# EAGLE design ECE411_G16_V10 (EAGLE 9.2.1)
Version 6: Added bypass capacitors to uC +Vcc, added test points for I2C.
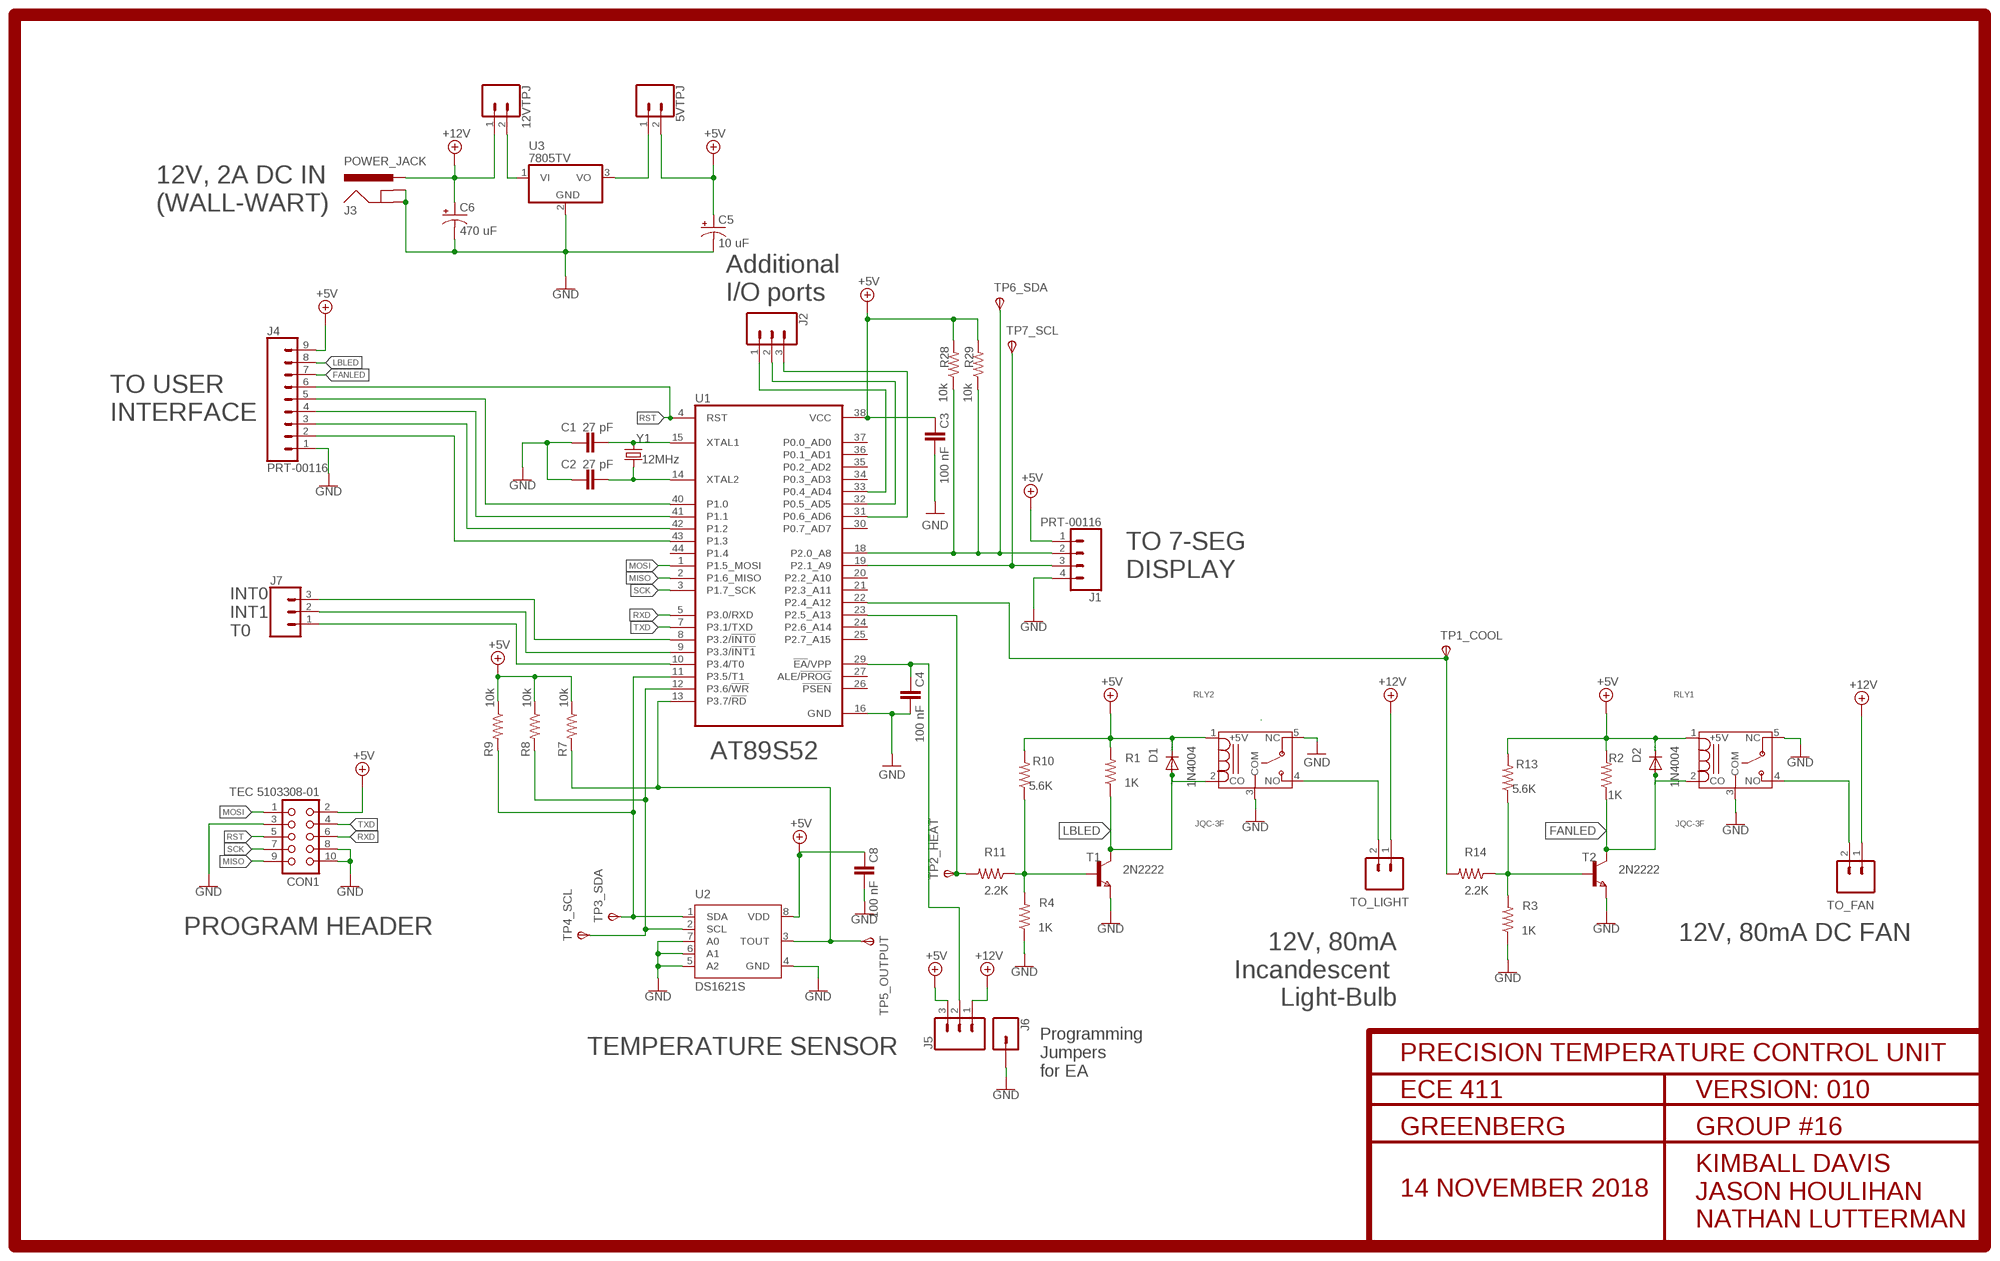
[diagram p0: schematic, sheet 1]

## Parts
5VTPJ  CONN_02  [1X02]
12VTPJ  CONN_02  [1X02]
C1  27 pF  CAPACITOR_0603_M  [RESC0603_M]
C2  27 pF  CAPACITOR_0603_M  [RESC0603_M]
C3  100 nF  CAPACITOR_0603_M  [RESC0603_M]
C4  100 nF  CAPACITOR_0603_M  [RESC0603_M]
C5  10 uF  CPOL-USTT2D6  [TT2D6]
C6  470 uF  CPOL-USTT5D11  [TT5D11]
C8  100 nF  CAPACITOR_0603_M  [RESC0603_M]
CON1  TEC 5103308-01  CON10  [CON10]
D1  1N4004  [DO41-10]
D2  1N4004  [DO41-10]
J1  PRT-00116  CONN_04  [1X04]
J2  CONN_03  [1X03]
J3  POWER_JACK  [POWER_JACK_PTH]
J4  PRT-00116  CONN_09  [1X09]
J5  CONN_03  [1X03]
J6  CONN_01  [1X01]
J7  CONN_03  [1X03]
R1  1K  R-US_R0603  [R0603]
R2  1K  R-US_R0603  [R0603]
R3  1K  R-US_R0603  [R0603]
R4  1K  R-US_R0603  [R0603]
R7  10k  R-US_R0603  [R0603]
R8  10k  R-US_R0603  [R0603]
R9  10k  R-US_R0603  [R0603]
R10  5.6K  R-US_R0603  [R0603]
R11  2.2K  R-US_R0603  [R0603]
R13  5.6K  R-US_R0603  [R0603]
R14  2.2K  R-US_R0603  [R0603]
R28  10k  R-US_R0603  [R0603]
R29  10k  R-US_R0603  [R0603]
RLY1  JQC-3F  [T073]
RLY2  JQC-3F  [T073]
T1  2N2222  NPNSOT23  [SOT-23]
T2  2N2222  NPNSOT23  [SOT-23]
TO_FAN  CONN_02  [1X02]
TO_LIGHT  CONN_02  [1X02]
TP1_COOL  TPSTP20SQ  [TP20SQ]
TP2_HEAT  TPSTP20SQ  [TP20SQ]
TP3_SDA  TPSTP20SQ  [TP20SQ]
TP4_SCL  TPSTP20SQ  [TP20SQ]
TP5_OUTPUT  TPSTP20SQ  [TP20SQ]
TP6_SDA  TPSTP20SQ  [TP20SQ]
TP7_SCL  TPSTP20SQ  [TP20SQ]
U1  AT89S52  AT89S51-24P  [TQFP44]
U2  DS1621S  [SO08]
U3  7805TV  [TO220V]
Y1  12MHz  CRYSTAL-12MHZ"  [CRYSTAL-SMD-5X3.2-4PAD]

## Nets
+5V: 5VTPJ.2 C3.2 C5.+ C8.2 CON1.2 D1.C D2.C J1.1 J4.9 J5.3 R1.2 R2.2 R7.1 R8.1 R9.1 R10.2 R13.2 R28.2 R29.2 RLY1.1(+5V) RLY2.1(+5V) U1.38(VCC) U2.8(VDD)
+12V: 12VTPJ.1 C6.+ J3.PWR J5.1 TO_FAN.1 TO_LIGHT.1
FANLED: D2.A J4.7 R2.1 RLY1.2(CO) T2.1(C)
GND: C1.1 C2.1 C3.1 C4.1 C5.- C6.- C8.1 CON1.3 CON1.8 CON1.10 J1.4 J3.GND J3.GNDBREAK J4.1 J6.1 R3.1 R4.1 RLY1.3(COM) RLY1.5(NC) RLY2.3(COM) RLY2.5(NC) T1.2(E) T2.2(E) U1.16(GND) U2.4(GND) U2.5(A2) U2.6(A1) U2.7(A0) U3.2(GND)
LBLED: D1.A J4.8 R1.1 RLY2.2(CO) T1.1(C)
MISO: CON1.9 U1.2(P1.6_MISO)
MOSI: CON1.1 U1.1(P1.5_MOSI)
N$1: C1.2 U1.15(XTAL1) Y1.1
N$2: C2.2 U1.14(XTAL2) Y1.3
N$3: J1.2 R28.1 R29.1 TP6_SDA.TP(PP) U1.18(P2.0_A8)
N$4: J1.3 TP7_SCL.TP(PP) U1.19(P2.1_A9)
N$5: 12VTPJ.2 U3.1(VI)
N$6: 5VTPJ.1 U3.3(VO)
N$7: RLY2.4(NO) TO_LIGHT.2
N$8: C4.2 J5.2 U1.29(!EA!/VPP)
N$9: R7.2 TP5_OUTPUT.TP(PP) U1.13(P3.7/!RD) U2.3(TOUT)
N$10: R8.2 TP4_SCL.TP(PP) U1.12(P3.6/!WR) U2.2(SCL)
N$11: R9.2 TP3_SDA.TP(PP) U1.11(P3.5/T1) U2.1(SDA)
N$12: R11.2 TP2_HEAT.TP(PP) U1.23(P2.5_A13)
N$13: R4.2 R10.1 R11.1 T1.3(B)
N$14: J2.1 U1.33(P0.4_AD4)
N$15: J2.2 U1.32(P0.5_AD5)
N$16: R14.2 TP1_COOL.TP(PP) U1.22(P2.4_A12)
N$17: R3.2 R13.1 R14.1 T2.3(B)
N$18: J2.3 U1.31(P0.6_AD6)
N$20: RLY1.4(NO) TO_FAN.2
N$21: J7.3 U1.8(P3.2/!INT0)
N$22: J7.2 U1.9(P3.3/!INT1)
N$23: J7.1 U1.10(P3.4/T0)
N$34: J4.5 U1.40(P1.0)
N$35: J4.4 U1.41(P1.1)
N$36: J4.3 U1.42(P1.2)
N$37: J4.2 U1.43(P1.3)
RST: CON1.5 J4.6 U1.4(RST)
RXD: CON1.6 U1.5(P3.0/RXD)
SCK: CON1.7 U1.3(P1.7_SCK)
TXD: CON1.4 U1.7(P3.1/TXD)
Unconnected: U1.20(P2.2_A10) U1.21(P2.3_A11) U1.24(P2.6_A14) U1.25(P2.7_A15) U1.26(!PSEN) U1.27(ALE/!PROG) U1.30(P0.7_AD7) U1.34(P0.3_AD3) U1.35(P0.2_AD2) U1.36(P0.1_AD1) U1.37(P0.0_AD0) U1.44(P1.4)

## Notes on the sheet
- 12V, 2A DC IN
  (WALL-WART)
- Additional
  I/O ports
- TO USER
  INTERFACE
- TO 7-SEG 
  DISPLAY
- INT0
  INT1
  T0
- AT89S52
- PROGRAM HEADER | 12V, 80mA DC FAN
- 12V, 80mA
  Incandescent 
  Light-Bulb
- TEMPERATURE SENSOR
- Programming
  Jumpers
  for EA

## Power pins joined to a net without a drawn wire
GND: U1.17(GND)

## Library data of the parts
5VTPJ 12VTPJ TO_FAN TO_LIGHT = SparkFun-Connectors:CONN_02: Multi connection point. Often used as Generic Header-pin footprint for 0.1 inch spaced/style header connections On any of the 0.1 inch spaced packages, you can populate with these: Break Away Headers - Straight <https://www.sparkfun.com/products/116> (PRT-00116) Break Away Male Headers - Right Angle <https://www.sparkfun.com/products/553> (PRT-00553) Female Headers <https://www.sparkfun.com/products/115> (PRT-00115) Break Away Headers - Machine Pin <https://www.sparkfun.com/products/117> (PRT-00117) Break Away Female Headers - Swiss Machine Pin <https://www.sparkfun.com/products/743> (PRT-00743) For SCREWTERMINALS and SPRING TERMINALS visit here: Screw Terimnals on SparkFun.com <https://www.sparkfun.com/search/results?term=Screw+Terminals> (5mm/3.5mm/2.54mm spacing) This device is also useful as a general connection point to wire up your design to another part of your project. Our various solder wires solder well into these plated through hole pads. Hook-Up Wire - Assortment (Stranded, 22 AWG) <https://www.sparkfun.com/products/11375> (PRT-11375) Hook-Up Wire - Assortment (Solid Core, 22 AWG) <https://www.sparkfun.com/products/11367> (PRT-11367) View the entire wire category on our website here <https://www.sparkfun.com/categories/141> Special notes: Molex polarized connector foot print use with: PRT-08233 with associated crimp pins and housings. 2.54_SCREWTERM for use with PRT-10571. 3.5mm Screw Terminal footprints for PRT-08084 5mm Screw Terminal footprints for use with PRT-08432
C1-C4 C8 = Nordic_nRF:CAPACITOR: Generic chip capacitor
C5 C6 = rcl:CPOL-US: POLARIZED CAPACITOR, American symbol; SPICEPREFIX: C
CON1 = con-harting:CON10: CONNECTOR; OC_FARNELL: unknown; OC_NEWARK: unknown
D1 D2 = diode:1N4004: DIODE general purpose rectifier, 1 A
J1 = SparkFun-Connectors:CONN_04: Multi connection point. Often used as Generic Header-pin footprint for 0.1 inch spaced/style header connections On any of the 0.1 inch spaced packages, you can populate with these: Break Away Headers - Straight <https://www.sparkfun.com/products/116> (PRT-00116) Break Away Male Headers - Right Angle <https://www.sparkfun.com/products/553> (PRT-00553) Female Headers <https://www.sparkfun.com/products/115> (PRT-00115) Break Away Headers - Machine Pin <https://www.sparkfun.com/products/117> (PRT-00117) Break Away Female Headers - Swiss Machine Pin <https://www.sparkfun.com/products/743> (PRT-00743) For SCREWTERMINALS and SPRING TERMINALS visit here: Screw Terimnals on SparkFun.com <https://www.sparkfun.com/search/results?term=Screw+Terminals> (5mm/3.5mm/2.54mm spacing) This device is also useful as a general connection point to wire up your design to another part of your project. Our various solder wires solder well into these plated through hole pads. Hook-Up Wire - Assortment (Stranded, 22 AWG) <https://www.sparkfun.com/products/11375> (PRT-11375) Hook-Up Wire - Assortment (Solid Core, 22 AWG) <https://www.sparkfun.com/products/11367> (PRT-11367) View the entire wire category on our website here <https://www.sparkfun.com/categories/141> Special notes: Molex polarized connector foot print use with SKU : PRT-08231 with associated crimp pins and housings. 1MM SMD Version SKU: PRT-10208; PROD_ID: CONN-09696
J2 J5 J7 = SparkFun-Connectors:CONN_03: Multi connection point. Often used as Generic Header-pin footprint for 0.1 inch spaced/style header connections On any of the 0.1 inch spaced packages, you can populate with these: Break Away Headers - Straight <https://www.sparkfun.com/products/116> (PRT-00116) Break Away Male Headers - Right Angle <https://www.sparkfun.com/products/553> (PRT-00553) Female Headers <https://www.sparkfun.com/products/115> (PRT-00115) Break Away Headers - Machine Pin <https://www.sparkfun.com/products/117> (PRT-00117) Break Away Female Headers - Swiss Machine Pin <https://www.sparkfun.com/products/743> (PRT-00743) Stackable Header - 3 Pin (Female, 0.1") <https://www.sparkfun.com/products/13875> (PRT-13875) For SCREWTERMINALS and SPRING TERMINALS visit here: Screw Terimnals on SparkFun.com <https://www.sparkfun.com/search/results?term=Screw+Terminals> (5mm/3.5mm/2.54mm spacing) This device is also useful as a general connection point to wire up your design to another part of your project. Our various solder wires solder well into these plated through hole pads. Hook-Up Wire - Assortment (Stranded, 22 AWG) <https://www.sparkfun.com/products/11375> (PRT-11375) Hook-Up Wire - Assortment (Solid Core, 22 AWG) <https://www.sparkfun.com/products/11367> (PRT-11367) View the entire wire category on our website here <https://www.sparkfun.com/categories/141> Special notes: Molex polarized connector foot print use with SKU : PRT-08232 with associated crimp pins and housings.
J3 = SparkFun-Connectors:POWER_JACK: Power Jack Connector This is the standard 5.5mm barrel jack for power. The PTH is the most common, proven, reliable, footprint. The Slot footprint only works if the mill layer is transmitted to the PCB fab house so be warned. Here are the connectors we sell at SparkFun: DC Barrel Power Jack/Connector <https://www.sparkfun.com/products/119> (PRT-00119) DC Barrel Power Jack/Connector (SMD) <https://www.sparkfun.com/products/12748> (PRT-12748) DC Barrel Jack Adapter - Breadboard Compatible <https://www.sparkfun.com/products/10811> (PRT-10811) It is used on this SparkFun product (and many, many others): SparkFun RedBoard - Programmed with Arduino <https://www.sparkfun.com/products/12757> (DEV-12757) Also, if you need a mating power supply or connector, please check these out: Wall Adapter Power Supply - 9VDC 650mA <https://www.sparkfun.com/products/298> (TOL-00298) DC Barrel Jack Adapter - Male <https://www.sparkfun.com/products/10287> (PRT-10287); PROD_ID: CONN-08197
J4 = SparkFun-Connectors:CONN_09: Multi connection point. Often used as Generic Header-pin footprint for 0.1 inch spaced/style header connections On any of the 0.1 inch spaced packages, you can populate with these: Break Away Headers - Straight <https://www.sparkfun.com/products/116> (PRT-00116) Break Away Male Headers - Right Angle <https://www.sparkfun.com/products/553> (PRT-00553) Female Headers <https://www.sparkfun.com/products/115> (PRT-00115) Break Away Headers - Machine Pin <https://www.sparkfun.com/products/117> (PRT-00117) Break Away Female Headers - Swiss Machine Pin <https://www.sparkfun.com/products/743> (PRT-00743) For SCREWTERMINALS and SPRING TERMINALS visit here: Screw Terimnals on SparkFun.com <https://www.sparkfun.com/search/results?term=Screw+Terminals> (5mm/3.5mm/2.54mm spacing) This device is also useful as a general connection point to wire up your design to another part of your project. Our various solder wires solder well into these plated through hole pads. Hook-Up Wire - Assortment (Stranded, 22 AWG) <https://www.sparkfun.com/products/11375> (PRT-11375) Hook-Up Wire - Assortment (Solid Core, 22 AWG) <https://www.sparkfun.com/products/11367> (PRT-11367) View the entire wire category on our website here <https://www.sparkfun.com/categories/141> Special notes: Molex polarized connector foot print use with SKU : PRT-08231 with associated crimp pins and housings. 1MM SMD Version SKU: PRT-10208 NOTES ON THE VARIANTS LOCK and LOCK_LONGPADS... This footprint was designed to help hold the alignment of a through-hole component (i.e. 6-pin header) while soldering it into place. You may notice that each hole has been shifted either up or down by 0.005 of an inch from it's more standard position (which is a perfectly straight line). This slight alteration caused the pins (the squares in the middle) to touch the edges of the holes. Because they are alternating, it causes a "brace" to hold the component in place. 0.005 has proven to be the perfect amount of "off-center" position when using our standard breakaway headers. Although looks a little odd when you look at the bare footprint, once you have a header in there, the alteration is very hard to notice. Also,if you push a header all the way into place, it is covered up entirely on the bottom side.
J6 = SparkFun-Connectors:CONN_01: Single connection point. Often used as Generic Header-pin footprint for 0.1 inch spaced/style header connections On any of the 0.1 inch spaced packages, you can populate with these: Break Away Headers - Straight <https://www.sparkfun.com/products/116> (PRT-00116) Break Away Male Headers - Right Angle <https://www.sparkfun.com/products/553> (PRT-00553) Female Headers <https://www.sparkfun.com/products/115> (PRT-00115) Break Away Headers - Machine Pin <https://www.sparkfun.com/products/117> (PRT-00117) Break Away Female Headers - Swiss Machine Pin <https://www.sparkfun.com/products/743> (PRT-00743) This device is also useful as a general connection point to wire up your design to another part of your project. Our various solder wires solder well into these plated through hole pads. Hook-Up Wire - Assortment (Stranded, 22 AWG) <https://www.sparkfun.com/products/11375> (PRT-11375) Hook-Up Wire - Assortment (Solid Core, 22 AWG) <https://www.sparkfun.com/products/11367> (PRT-11367) View the entire wire category on our website here <https://www.sparkfun.com/categories/141> Special notes: SMTSO-256-ET is a "flush mount" nut for a 4-40 screw. We mostly use this on specialty testbeds; it is a nice way to connect hardware to your PCB at an adjustable hieght. Also note, the SNAP packages are for using a snappable style connector. We sell a baggie of snaps and they are also used on two LilyPad designs: Snap Assortment - 30 pack (male and female) <https://www.sparkfun.com/products/11347> (DEV-11347) LilyPad Arduino SimpleSnap <https://www.sparkfun.com/products/10941> (DEV-10941) LilyPad SimpleSnap Protoboard <https://www.sparkfun.com/products/10940> (DEV-10940)
R1-R4 R7-R11 R13 R14 R28 R29 = audio amplifier example:R-US_: RESISTOR, American symbol
RLY1 RLY2 = JQC-3F:JQC-3F
T1 T2 = zetex:NPNSOT23: NPN TRANSISTOR; MPN: DSS20201L-7; OC_FARNELL: 1710688; OC_NEWARK: 25R4555
TP1_COOL TP2_HEAT TP3_SDA TP4_SCL TP5_OUTPUT TP6_SDA TP7_SCL = testpad:TPS: TEST PIN
U1 = atmel:AT89S51*P: 8-bit Microcontroller with 4K BytesIn-System Programmable Flash Source: http://www.atmel.com/dyn/resources/prod_documents/doc2487.pdf; OC_FARNELL: unknown; OC_NEWARK: unknown
U2 = maxim:DS1621: Digital Thermometer and Thermostat Source: http://pdfserv.maxim-ic.com/en/ds/DS1621.pdf; MF: DALLAS SEMICONDUCTOR; MPN: DS1621S+; OC_FARNELL: 9725261; OC_NEWARK: 23K3501
U3 = linear:78*: Positive VOLTAGE REGULATOR Source: http://cache.national.com/ds/LM/LM78L05.pdf http://www.fairchildsemi.com/ds/LM/LM7805.pdf
Y1 = SparkFun-Clocks:CRYSTAL-12MHZ: 12.0MHz Crystal Frequency: 12.0MHz Frequency Tolerance: ±20ppm Load Capacitance: 18pF SparkFun Products: SparkFun Logomatic <https://www.sparkfun.com/products/12772> Pocket AVR Programmer <https://www.sparkfun.com/products/9825>; PROD_ID: XTAL-08297

## Board
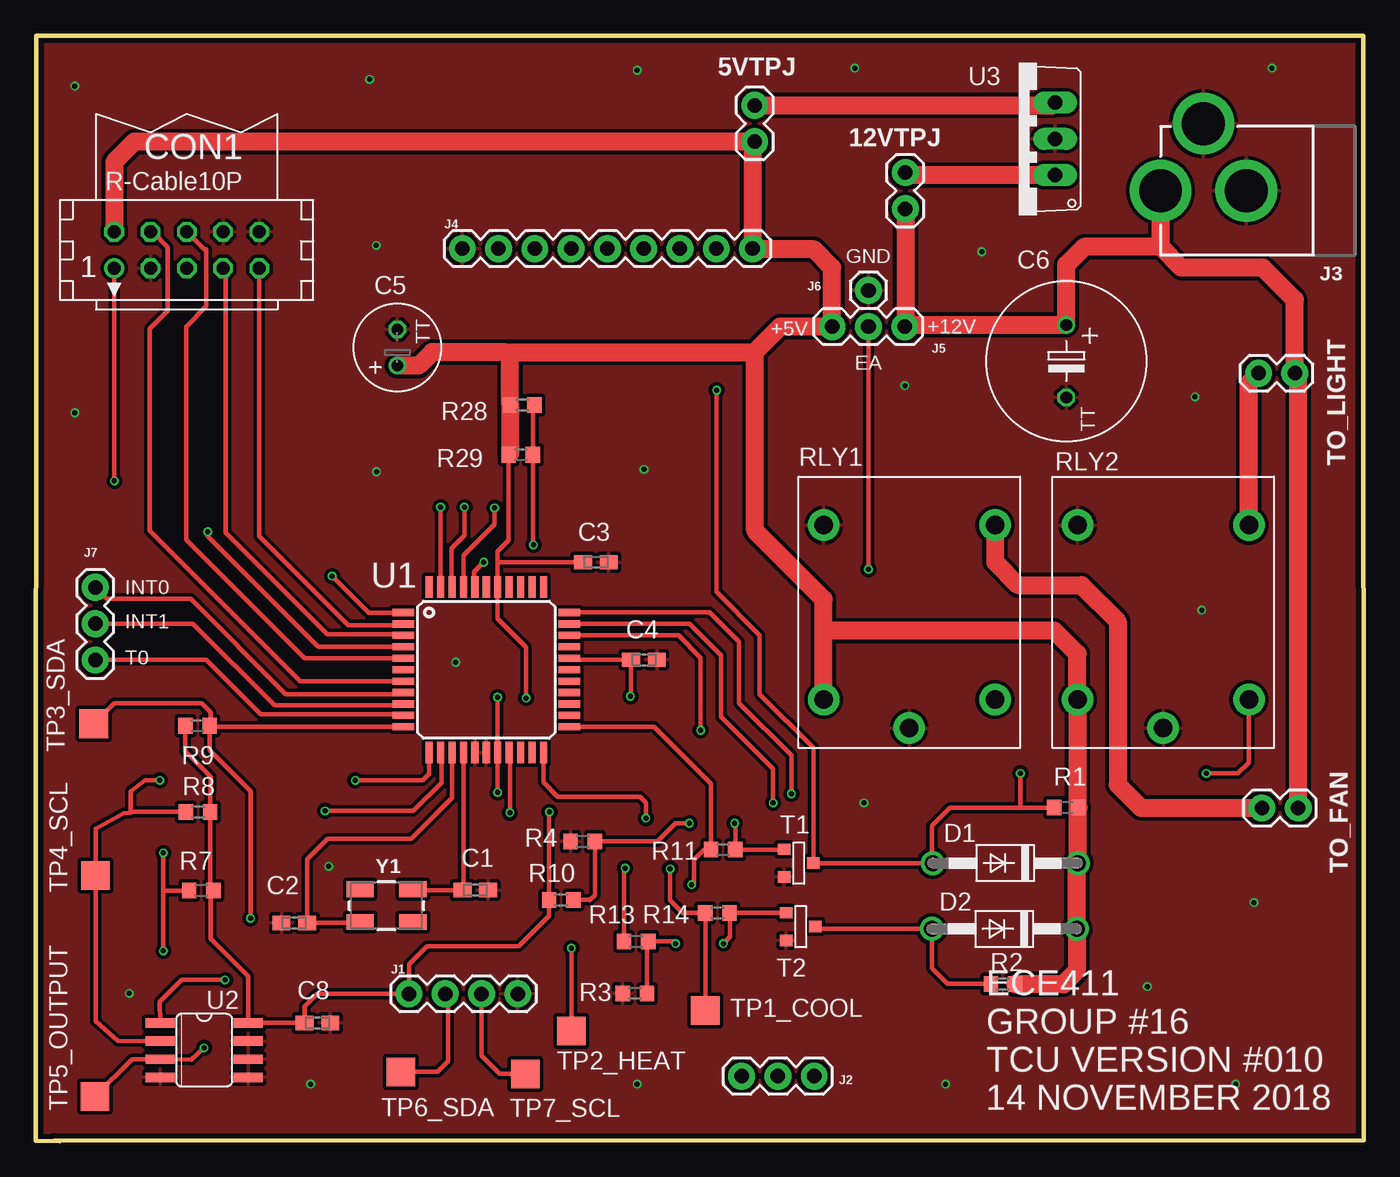
[diagram p1: board, top side]
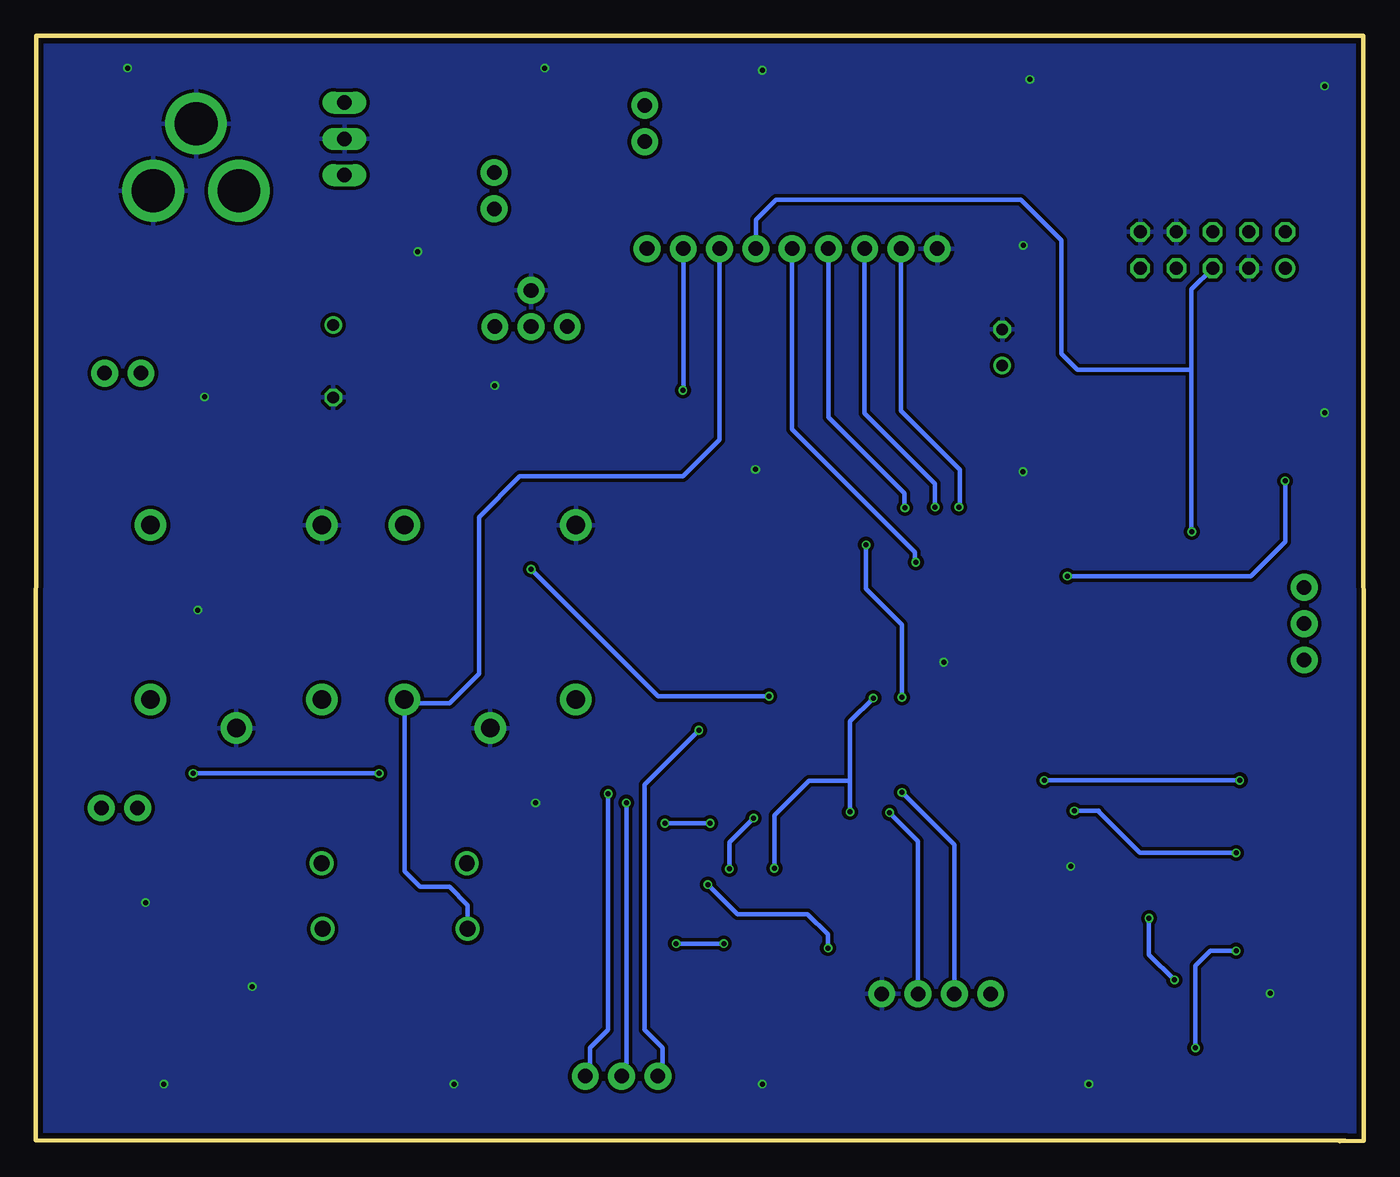
[diagram p2: board, bottom side, seen from below]

Size 92.99 x 77.37 mm. Coordinates in mm from the lower left corner, seen from the top.
Outline: 1.3,0.03 92.99,0.05 92.96,77.37 0.05,77.37 0,0.03 1.68,0
Copper layers (1*16): Top 0.035559375mm / dielectric 1.6mm / Bottom 0.035559375mm
Design rules "2LAYER": minimum track width 6mil, minimum drill 10mil, track to track 6mil, track to pad 6mil, pad to pad 6mil, via to via 6mil, smd to smd 6mil, copper to edge 15mil, drill to drill 6mil, minimum pad ring 5mil, minimum via ring 5mil, stop-mask expansion 2.5mil, vias tented up to drill 0mil, thermal gap 10mil

### Footprints (pad centres in the part's own frame; a part is rotated, then mirrored left to right if it is on the bottom)
1X02 = drill 1.016 pad 1.88: 1 0,0; 2 2.54,0
RESC0603_M = smd 1.25 x 1: 1 -0.9,0; 2 0.9,0
TT2D6 = drill 0.813: + -1.27,0 | drill 0.813 octagon: - 1.27,0
TT5D11 = drill 0.813: + -2.54,0 | drill 0.813 octagon: - 2.54,0
CON10 = drill 0.914: 1 -5.08,-1.27 | drill 0.914 octagon: 2 -5.08,1.27; 3 -2.54,-1.27; 4 -2.54,1.27; 5 0,-1.27; 6 0,1.27; 7 2.54,-1.27; 8 2.54,1.27; 9 5.08,-1.27; 10 5.08,1.27
DO41-10 = drill 1.118: A 5.08,0; C -5.08,0
1X04 = drill 1.016 pad 1.88: 1 0,0; 2 2.54,0; 3 5.08,0; 4 7.62,0
1X03 = drill 1.016 pad 1.88: 1 0,0; 2 2.54,0; 3 5.08,0
POWER_JACK_PTH = drill 2.997 pad 4.318: GND 0,7.7; GNDBREAK 4.7,10.7; PWR 0,13.7
1X09 = drill 1.016 pad 1.88: 1 0,0; 2 2.54,0; 3 5.08,0; 4 7.62,0; 5 10.16,0; 6 12.7,0; 7 15.24,0; 8 17.78,0; 9 20.32,0
1X01 = drill 1.016 pad 1.88: 1 0,0
R0603 = smd 1 x 1.1: 1 -0.85,0; 2 0.85,0
T073 = drill 1.3 pad 2.2: 1 6.1,-6; 2 6.1,6; 3 8.1,0; 4 -6.1,6; 5 -6.1,-6
SOT-23 = smd 0.787 x 0.889: 1 0.025,-1.016; 2 -0.94,1.016; 3 0.991,1.016
TP20SQ = smd 2 x 2: TP 0,0
TQFP44 = smd 1.5 x 0.5: 1 -5.8,4; 2 -5.8,3.2; 3 -5.8,2.4; 4 -5.8,1.6; 5 -5.8,0.8; 6 -5.8,0; 7 -5.8,-0.8; 8 -5.8,-1.6; 9 -5.8,-2.4; 10 -5.8,-3.2; 11 -5.8,-4; 23 5.8,-4; 24 5.8,-3.2; 25 5.8,-2.4; 26 5.8,-1.6; 27 5.8,-0.8; 28 5.8,0; 29 5.8,0.8; 30 5.8,1.6; 31 5.8,2.4; 32 5.8,3.2; 33 5.8,4 | smd 0.5 x 1.5: 12 -4,-5.8; 13 -3.2,-5.8; 14 -2.4,-5.8; 15 -1.6,-5.8; 16 -0.8,-5.8; 17 0,-5.8; 18 0.8,-5.8; 19 1.6,-5.8; 20 2.4,-5.8; 21 3.2,-5.8; 22 4,-5.8; 34 4,5.8; 35 3.2,5.8; 36 2.4,5.8; 37 1.6,5.8; 38 0.8,5.8; 39 0,5.8; 40 -0.8,5.8; 41 -1.6,5.8; 42 -2.4,5.8; 43 -3.2,5.8; 44 -4,5.8
SO08 = smd 0.66 x 2.032: 1 -1.905,-3.073; 2 -0.635,-3.073; 3 0.635,-3.073; 4 1.905,-3.073; 5 1.905,3.073; 6 0.635,3.073; 7 -0.635,3.073; 8 -1.905,3.073
TO220V = drill 1.016 long: 1 -2.54,-2.54; 2 0,-2.54; 3 2.54,-2.54
CRYSTAL-SMD-5X3.2-4PAD = smd 1.9 x 1.1: 1 -1.85,-1.15; 2 1.85,-1.15; 3 1.85,1.15; 4 -1.85,1.15

### Placement (x,y rotation side)
5VTPJ  50.34,72.49 270 top
12VTPJ  60.88,65.25 90 top
C1  30.78,17.57 180 top
C2  18.11,15.27 0 top
C3  39.22,40.51 180 top
C4  42.59,33.69 180 top
C5  25.32,55.55 90 top
C6  72.16,54.59 270 top
C8  19.73,8.27 180 top
CON1  10.58,62.36 0 top
D1  67.88,19.46 180 top
D2  67.82,14.85 180 top
J1  26.13,10.31 0 top
J2  54.51,4.55 180 top
J3  92.46,66.52 90 top
J4  29.87,62.47 0 top
J5  60.85,57.01 180 top
J6  58.31,59.55 0 top
J7  4.17,33.67 90 top
R1  72.16,23.35 0 top
R2  67.72,11 0 top
R3  41.95,10.34 0 top
R4  38.3,20.97 0 top
R7  11.6,17.54 180 top
R8  11.37,23.04 180 top
R9  11.33,29.08 0 top
R10  36.79,16.88 180 top
R11  48.14,20.4 180 top
R13  42.04,13.97 180 top
R14  47.73,15.97 180 top
R28  34.07,51.52 180 top
R29  33.96,48.04 180 top
RLY1  61.16,37.01 270 top
RLY2  78.94,37.01 270 top
T1  53.42,19.43 90 top
T2  53.56,14.99 90 top
TO_FAN  88.39,23.32 180 top
TO_LIGHT  88.16,53.75 180 top
TP1_COOL  46.88,9.15 0 top
TP2_HEAT  37.49,7.72 0 top
TP3_SDA  4.06,29.21 180 top
TP4_SCL  4.2,18.58 180 top
TP5_OUTPUT  4.13,3.12 0 top
TP6_SDA  25.58,4.85 0 top
TP7_SCL  34.29,4.7 0 top
U1  31.55,32.99 0 top
U2  11.79,6.36 270 top
U3  68.83,70.15 90 top
Y1  24.56,16.48 180 top

### Tracks (layer width: path | path; a pad name or v marks a point on that pad's centre or on a via)
+5V  (via drill 0.35)
  Top 0.305: 32.33,40.5 32.33,41.27 33.11,42.05 R29.2 33.22,48.14 | 32.33,40.5 U1.38 32.35,36.56 34.34,34.57 v34.34,31.01 | v35.97,23.04 35.94,23.01 R10.2 35.94,15.78 33.81,13.64 27.41,13.64 26.13,12.36 J1.1 19.7,10.31 18.83,9.44 C8.2 U2.8 14.87,11.55 12.27,14.15 12.27,17.35 R7.1 12.22,17.55 R8.1 12.24,25.5 10.47,27.28 R9.1 | R13.2 41.19,19.02 v41.28,19.1 | C3.2 38.31,40.5 32.33,40.5
  Top 1.27: 33.22,48.14 R28.2 33.22,54.82 32.82,55.22 | 32.82,55.22 27.74,55.22 26.79,54.28 C5.+ | CON1.2 5.5,68.54 6.91,69.95 5VTPJ.2 50.19,69.8 J4.9 50.25,62.41 54.5,62.41 55.77,61.14 J5.3 52.11,57.01 50.37,55.26 | RLY1.1 55.16,35.74 | 55.16,35.74 55.16,37.93 50.37,42.72 50.37,55.26 | 55.16,35.74 71.32,35.74 72.94,34.12 RLY2.1 72.94,23.42 72.96,23.4 | 72.96,23.4 R1.2 | 72.96,23.4 D1.C 72.9,19.39 D2.C 72.9,11.91 71.96,10.97 68.6,10.97 R2.2 | 50.37,55.26 50.32,55.22 32.82,55.22
  Bottom 0.305: v35.97,23.04 35.97,25.22 | 35.97,25.22 35.97,29.39 v34.34,31.01 | 35.97,25.22 38.86,25.22 41.28,22.81 v41.28,19.1
+12V
  Top 1.27: 78.76,62.59 J3.PWR | 78.76,62.59 80.21,61.14 85.93,61.14 88.16,58.9 TO_LIGHT.1 88.39,53.52 TO_FAN.1 | 78.76,62.59 73.41,62.59 72.16,61.34 C6.+ 60.97,57.13 J5.1 60.88,57.05 12VTPJ.1
FANLED
  Top 0.305: T2.1 54.74,14.85 D2.A 62.75,14.84 62.75,12.08 63.84,11 R2.1
  Bottom 0.305: D2.A 62.74,16.51 64.02,17.8 66.08,17.8 67.16,18.88 67.16,30.66 | 67.16,30.66 RLY1.2 | J4.7 45.11,49.1 47.67,46.53 59.1,46.53 61.96,43.68 61.96,32.72 64.02,30.66 67.16,30.66
GND  (via drill 0.35)
  other vias: 23.38,74.31 57.35,75.11 85.29,16.69 63.7,3.99 42.11,3.99 19.25,3.99 6.55,10.34 23.86,46.85 29.41,33.52 2.74,73.84 2.74,50.98 20.52,19.23 84.02,3.99 77.83,10.81 86.56,75.11 23.85,62.69 60.85,52.88 81.17,52.09 66.24,62.25 42.59,47.01 81.64,37.17 57.99,23.67 42.11,74.95
  pour Bottom (isolate 0.254): -3.64,78.39 -3.64,-2.17 93.8,-2.17 93.8,78.39
  pour Top (isolate 0.254): -1.91,-1.68 93.57,-1.68 93.57,77.75 -1.91,77.75
LBLED  (via drill 0.35)
  Top 0.305: D1.A T1.1 54.44,27.54 50.69,31.29 50.69,35.42 47.67,38.44 47.67,52.7 47.68,52.7 v47.68,52.55 | RLY2.2 84.94,26.5 84.18,25.74 v81.96,25.74 | R1.1 68.94,23.35 | 68.94,23.35 64.01,23.35 62.75,22.08 62.75,19.51 | v68.94,25.74 68.94,23.35
  Top 1.27: 62.75,19.51 D1.A
  Bottom 0.305: J4.8 47.65,52.58 v47.68,52.55 | v81.96,25.74 v68.94,25.74
MISO
  Top 0.305: CON1.9 15.66,42.33 21.87,36.12 25.67,36.12 U1.2
MOSI  (via drill 0.35)
  Top 0.305: CON1.1 5.5,46.22 v5.51,46.2 | v20.75,39.55 23.31,36.99 U1.1
  Bottom 0.305: v5.51,46.2 5.51,41.96 7.93,39.55 v20.75,39.55
N$1
  Top 0.305: Y1.1 26.48,17.57 C1.2 29.95,17.63 U1.15
N$2
  Top 0.305: Y1.3 22.65,15.27 C2.2 19.01,19.72 20.45,21.16 26.29,21.16 29.15,24.02 U1.14
N$3  (via drill 0.35)
  Top 0.305: v34.85,41.73 34.81,41.77 R29.1 34.81,51.52 R28.1 | v32.33,31.06 U1.18 | U1.18 | v32.33,24.41 U1.18 | TP6_SDA.TP 28.14,4.85 28.88,5.59 28.88,10.1 J1.2
  Bottom 0.305: v34.85,41.73 34.85,38.66 32.33,36.14 v32.33,31.06 | J1.2 28.67,20.75 v32.33,24.41
N$4  (via drill 0.35)
  Top 0.305: v33.2,22.99 33.2,27.14 U1.19 | TP7_SCL.TP 32.49,4.7 31.22,5.97 J1.3
  Bottom 0.305: J1.3 31.21,21 v33.2,22.99
N$5
  Top 1.27: U3.1 61.07,67.6 12VTPJ.2
N$6
  Top 1.27: 5VTPJ.1 71.17,72.49 U3.3
N$7
  Top 1.27: RLY2.4 84.94,53.07 TO_LIGHT.2
N$8  (via drill 0.35)
  Top 0.305: U1.29 37.45,33.69 C4.2 41.69,31.19 v41.64,31.13 | v58.31,40.02 J5.2
  Bottom 0.305: v58.31,40.02 49.42,31.13 v41.64,31.13
N$9  (via drill 0.35)
  Top 0.305: U2.3 8.61,5.73 | 8.61,5.73 6.74,5.73 TP5_OUTPUT.TP | v20.27,23.11 26.44,23.11 28.42,25.09 28.42,27.12 U1.13 | v8.94,20.17 8.94,17.54 | 8.94,17.54 v8.94,13.31 | R7.2 9.02,17.54 8.94,17.54 | v11.79,6.53 10.87,5.69 8.61,5.73
  Bottom 0.305: v20.27,23.11 18.55,23.11 18.54,23.04 15.67,20.17 v8.94,20.17 | v11.79,6.53 11.79,12.27 10.74,13.31 v8.94,13.31
N$10  (via drill 0.35)
  Top 0.305: U1.12 27.55,25.72 27.08,25.25 v22.38,25.25 | v8.69,25.25 7.67,25.25 6.66,24.49 6.65,23.04 | 6.65,23.04 6.65,22.97 6.15,22.96 4.2,21.85 TP4_SCL.TP 4.19,8.38 5.74,7.04 U2.2 | R8.2 6.65,23.04
  Bottom 0.305: v22.38,25.25 v8.69,25.25
N$11  (via drill 0.35)
  Top 0.305: U1.11 12.26,28.99 | 12.26,28.99 | 12.26,28.99 R9.2 12.18,27.34 15.04,24.49 v15.04,15.6 | v13.26,11.28 10.21,11.28 8.69,9.75 U2.1 | TP3_SDA.TP 5.51,30.66 11.63,30.66 12.27,30.02 12.27,29 12.26,28.99
  Bottom 0.305: v15.04,15.6 15.04,13.06 v13.26,11.28
N$12  (via drill 0.35)
  Top 0.305: TP2_HEAT.TP 37.51,7.73 v37.51,13.51 | v45.92,17.96 46.08,18.12 46.08,19.7 46.78,20.4 R11.2 47.29,25.01 43.3,28.99 U1.23
  Bottom 0.305: v37.51,13.51 37.51,14.46 38.94,15.89 43.86,15.89 v45.92,17.96
N$13  (via drill 0.35)
  Top 0.305: T1.3 52.39,20.4 R11.1 48.99,22.2 v48.94,22.24 | R10.1 38.75,16.88 38.78,16.85 39.15,17.22 R4.2 43.54,20.97 44.81,22.24 v45.76,22.24
  Bottom 0.305: v48.94,22.24 v45.76,22.24
N$14  (via drill 0.35)
  Top 0.305: v52.91,24.31 52.91,27.01 49.26,30.66 49.26,34.94 47.19,37.01 37.36,37.01 U1.33
  Bottom 0.305: v52.91,24.31 52.91,7.8 54.18,6.53 54.18,4.88 J2.1
N$15  (via drill 0.35)
  Top 0.305: v51.64,23.67 51.64,26.05 47.99,29.7 47.99,33.99 45.76,36.21 45.75,36.19 U1.32
  Bottom 0.305: v51.64,23.67 51.64,4.88 J2.2
N$16  (via drill 0.35)
  Top 0.305: TP1_COOL.TP R14.2 45.35,15.97 45.34,15.95 44.42,16.87 v44.42,19.05 | U1.22 35.55,25.11 36.55,24.1 42.32,24.1 42.72,23.7 v42.72,22.61
  Bottom 0.305: v42.72,22.61 44.42,20.9 v44.42,19.05
N$17  (via drill 0.35)
  Top 0.305: R14.1 48.62,15.97 | 48.62,15.97 52.53,15.97 T2.3 | R3.2 42.8,13.88 R13.1 44.67,13.97 v44.81,13.83 | v48.15,13.83 48.62,14.31 48.62,15.97
  Bottom 0.305: v44.81,13.83 v48.15,13.83
N$18  (via drill 0.35)
  Top 0.305: U1.31 45,35.39 46.56,33.83 v46.56,28.75
  Bottom 0.305: v46.56,28.75 50.37,24.94 50.37,7.8 49.1,6.53 49.1,4.88 J2.3
N$20
  Top 1.27: RLY1.4 67.16,40.53 68.78,38.91 73.23,38.91 75.77,36.37 75.77,24.94 77.39,23.32 TO_FAN.2
N$21
  Top 0.305: J7.3 4.97,37.96 10.84,37.96 17.51,31.29 25.65,31.29 U1.8
N$22
  Top 0.305: J7.2 11,36.21 16.71,30.5 25.65,30.5 U1.9
N$23
  Top 0.305: J7.1 11.95,33.67 15.76,29.86 25.68,29.86 U1.10
N$34  (via drill 0.35)
  Top 0.305: v31.37,40.51 30.71,39.85 30.71,38.83 U1.40
  Bottom 0.305: J4.5 40.03,50.65 40.03,49.83 31.42,41.22 31.42,40.56 v31.37,40.51
N$35  (via drill 0.35)
  Top 0.305: v32.13,44.32 32.13,43.18 29.95,41 U1.41
  Bottom 0.305: J4.4 37.49,50.67 32.16,45.34 32.16,44.32 v32.13,44.32
N$36  (via drill 0.35)
  Top 0.305: v30.02,44.37 30.02,42.42 29.11,41.5 29.11,38.83 U1.42
  Bottom 0.305: J4.3 34.95,50.95 30.02,46.02 v30.02,44.37
N$37  (via drill 0.35)
  Top 0.305: v28.35,44.37 U1.43
  Bottom 0.305: J4.2 32.41,51.13 28.27,46.99 28.27,44.63 28.4,44.5 28.4,44.42 v28.35,44.37
RST  (via drill 0.35)
  Top 0.305: U1.4 19.79,34.59 12.04,42.34 v12.04,42.65
  Bottom 0.305: CON1.5 12.07,59.61 12.07,53.99 | 12.07,53.99 12.07,42.67 v12.04,42.65 | J4.6 42.57,64.49 41.16,65.9 24.02,65.9 21.16,63.04 21.16,55.11 20.05,53.99 12.07,53.99
RXD
  Top 0.305: U1.5 18.82,33.79 10.52,42.09 10.52,57.01 11.95,58.44 11.95,62.41 11.8,62.41 CON1.6
SCK
  Top 0.305: CON1.7 13.29,60.92 13.29,42.59 20.42,35.46 25.68,35.46 U1.3
TXD
  Top 0.305: U1.7 18.51,32.19 7.98,42.72 7.98,56.85 9.25,58.12 9.25,62.57 8.18,63.63 CON1.4

### Text on the board
tPlace: ECE411 / GROUP #16 / TCU VERSION #010 / 14 NOVEMBER 2018
tNames: GND | +5V | +12V | EA | INT0 | INT1 | T0
Notes: ADD I/O